# EAGLE design punta (EAGLE 7.5.0)
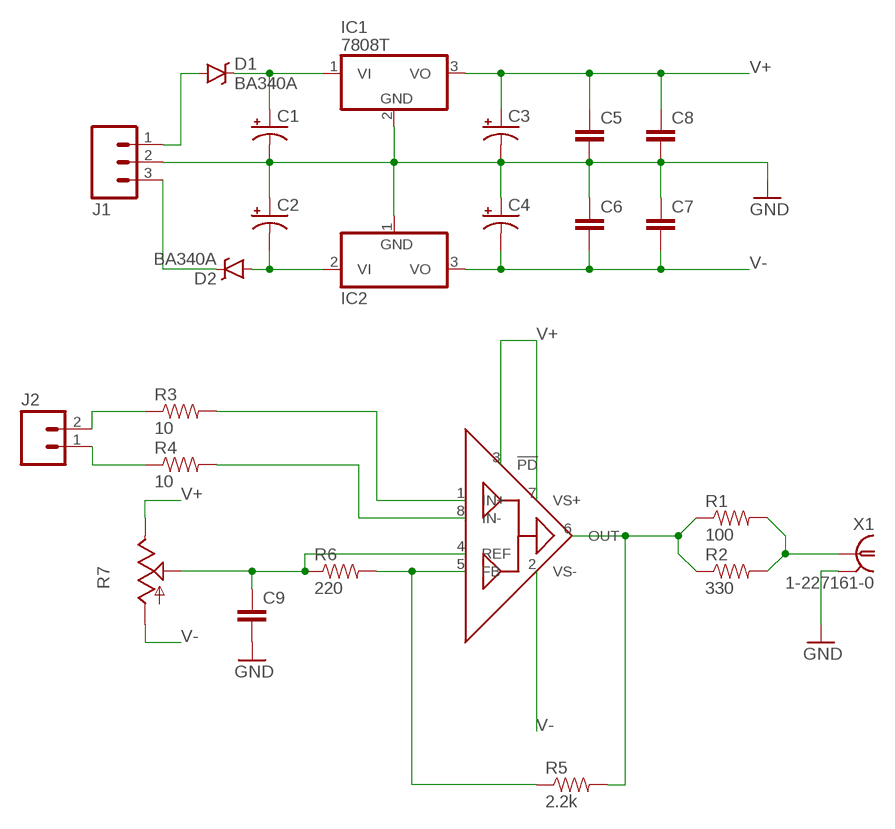
[diagram p0: schematic, sheet 1]

## Parts
C1  CAP_POL1206-KIT  [EIA3216-KIT]
C2  CAP_POL1206-KIT  [EIA3216-KIT]
C3  CAP_POL1206-KIT  [EIA3216-KIT]
C4  CAP_POL1206-KIT  [EIA3216-KIT]
C5  CAP0805  [0805]
C6  CAP0805  [0805]
C7  CAP0805  [0805]
C8  CAP0805  [0805]
C9  CAP0805  [0805]
D1  BA340A  B340A  [SMA-DIODE]
D2  BA340A  B340A  [SMA-DIODE]
IC1  7808T  [TO220H]
IC2  7908T  [TO220H]
J1  M03-SCREW-5MM  [SCREWTERMINAL-5MM-3]
J2  M02PTH  [1X02]
R1  100  RESISTOR0805-RES  [0805]
R2  330  RESISTOR0805-RES  [0805]
R3  10  RESISTOR0805-RES  [0805]
R4  10  RESISTOR0805-RES  [0805]
R5  2.2k  RESISTOR0805-RES  [0805]
R6  220  RESISTOR0805-RES  [0805]
R7  TRIM_US-B64Y  [B64Y]
U$1  AD8129ARZ  [SOIC8]
X1  1-227161-0  [AMP_227161]

## Nets
GND: C1.C(-) C2.A(+) C3.C(-) C4.A(+) C5.2 C6.1 C7.1 C8.2 C9.2 IC1.2(GND) IC2.1(GND) J1.2 X1.2
N$1: D1.A J1.1
N$2: C1.A(+) D1.C IC1.1(VI)
N$3: R1.1 R2.1 R5.2 U$1.6(OUT)
N$4: C2.C(-) D2.A IC2.2(VI)
N$5: D2.C J1.3
N$6: R1.2 R2.2 X1.1
N$8: R3.2 U$1.1(IN+)
N$9: R4.2 U$1.8(IN-)
N$10: J2.2 R3.1
N$11: J2.1 R4.1
N$12: R5.1 R6.2 U$1.5(FB)
N$13: C9.1 R6.1 R7.S U$1.4(REF)
V+: C3.A(+) C5.1 C8.1 IC1.3(VO) R7.E U$1.3(!PD) U$1.7(VS+)
V-: C4.C(-) C6.2 C7.2 IC2.3(VO) R7.A U$1.2(VS-)

## Library data of the parts
C1-C4 = SparkFun-Capacitors:CAP_POL: Capacitor Polarized These are standard SMD and PTH capacitors. Normally 10uF, 47uF, and 100uF in electrolytic and tantalum varieties. Always verify the external diameter of the through hole cap, it varies with capacity, voltage, and manufacturer. The EIA devices should be standard.
C5-C9 = SparkFun-Capacitors:CAP: Capacitor Standard 0603 ceramic capacitor, and 0.1" leaded capacitor.
D1 D2 = SparkFun-DiscreteSemi:B340A: Schottky Diode 3A-40V; PROD_ID: DIO-09886
IC1 = linear:78*: Positive VOLTAGE REGULATOR Source: http://cache.national.com/ds/LM/LM78L05.pdf http://www.fairchildsemi.com/ds/LM/LM7805.pdf
IC2 = linear:79*: Negative VOLTAGE REGULATOR
J1 = SparkFun-Connectors:M03: Header 3 Standard 3-pin 0.1" header. Use with straight break away headers (SKU : PRT-00116), right angle break away headers (PRT-00553), swiss pins (PRT-00743), machine pins (PRT-00117), and female headers (PRT-00115). Molex polarized connector foot print use with SKU : PRT-08232 with associated crimp pins and housings.; STOREFRONT_ID: PRT-08433
J2 = SparkFun-Connectors:M02: Standard 2-pin 0.1" header. Use with - straight break away headers ( PRT-00116) - right angle break away headers (PRT-00553) - swiss pins (PRT-00743) - machine pins (PRT-00117) - female headers (PRT-00115) Molex polarized connector foot print use with: PRT-08233 with associated crimp pins and housings. 2.54_SCREWTERM for use with PRT-10571. 3.5mm Screw Terminal footprints for PRT-08084 5mm Screw Terminal footprints for use with PRT-08432
R1-R6 = SparkFun-Passives:RESISTOR: Resistor Basic schematic elements and footprints for 0603, 1206, and PTH resistors.
R7 = pot:TRIM_US-: POTENTIOMETER
U$1 = AD8129:AD8129: Low Cost 200 MHz Differential Receiver Amplifier
X1 = con-coax:?227161*: JACK, RIGHT ANGLE, 50 OHM, PCB, BNC Source: amp_227161.pdf; MF: TYCO ELECTRONICS; MPN: 1-227161; OC_FARNELL: unknown; OC_NEWARK: 33B3200

## Board
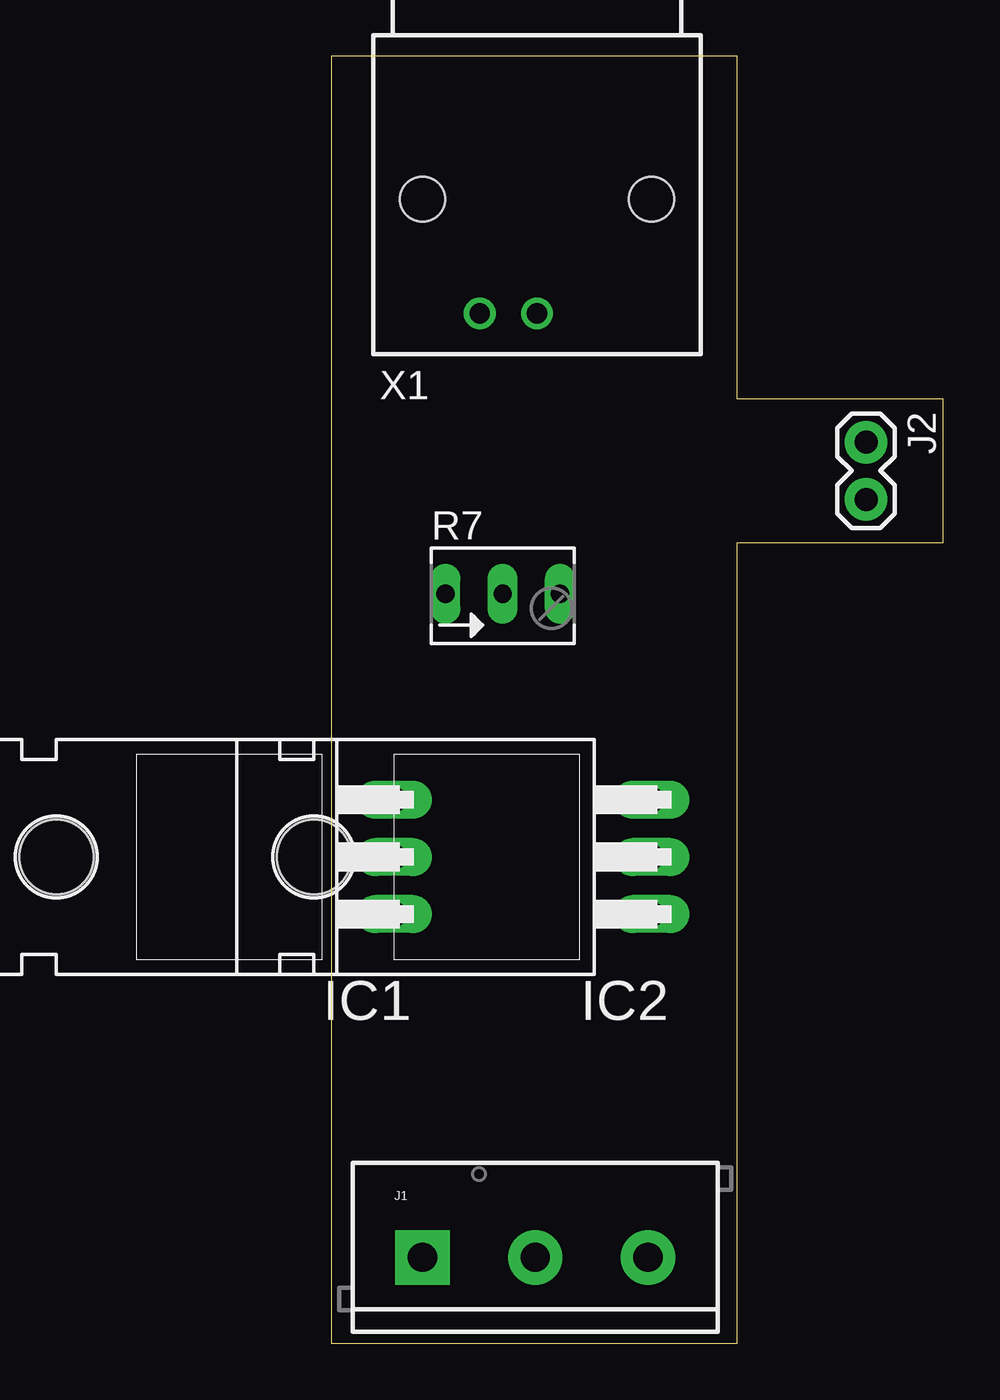
[diagram p1: board, top side]
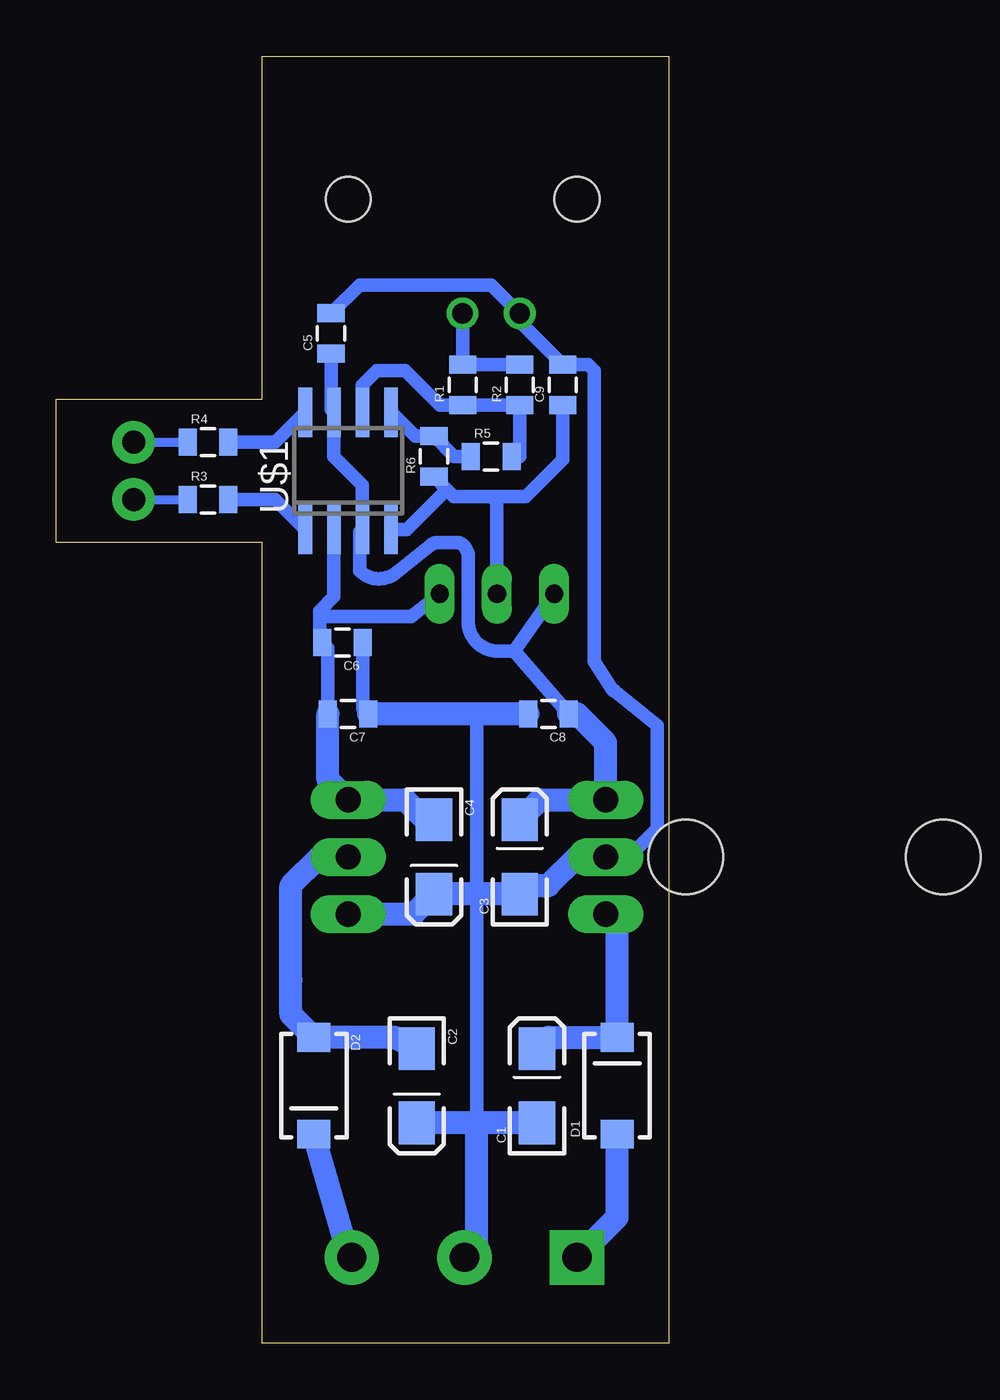
[diagram p2: board, bottom side, seen from below]

Size 27.18 x 57.14 mm. Coordinates in mm from the lower left corner, seen from the top.
Outline: 0,0 18.03,0 18.03,35.56 27.18,35.56 27.18,41.91 18.03,41.91 18.03,57.14 0,57.14 0,0
Copper layers (1*16): Top 0.035mm / dielectric 1.5mm / Bottom 0.035mm
Design rules "default": minimum track width 10mil, minimum drill 24mil, track to track 8mil, track to pad 8mil, pad to pad 8mil, via to via 8mil, smd to smd 8mil, copper to edge 40mil, drill to drill 8mil, minimum pad ring 10mil, minimum via ring 8mil, stop-mask expansion 4mil, vias tented up to drill 0mil, thermal gap 10mil

### Footprints (pad centres in the part's own frame; a part is rotated, then mirrored left to right if it is on the bottom)
EIA3216-KIT = smd 1.9 x 1.6: A 1.65,0; C -1.65,0
0805 = smd 0.8 x 1.2: 1 -0.9,0; 2 0.9,0
SMA-DIODE = smd 1.27 x 1.47: A -2.15,0; C 2.15,0
TO220H = drill 1.118 long: 1 -2.54,-10.16; 2 0,-10.16; 3 2.54,-10.16 | hole 3.302: 0,4.826
SCREWTERMINAL-5MM-3 = drill 1.3 pad 2.413 square: 1 0,0 | drill 1.3 pad 2.413: 2 5,0; 3 10,0
1X02 = drill 1.016 pad 1.88: 1 0,0; 2 2.54,0
B64Y = drill 0.813 long: A 2.54,0; E -2.54,0; S 0,0
SOIC8 = smd 0.6 x 2.2: 1 -1.905,-2.6; 2 -0.635,-2.6; 3 0.635,-2.6; 4 1.905,-2.6; 5 1.905,2.6; 6 0.635,2.6; 7 -0.635,2.6; 8 -1.905,2.6
AMP_227161 = drill 0.9 pad 1.27: 1 0,-5.08; 2 -2.54,-5.08 | hole 2: -5.08,0; 5.08,0

### Placement (x,y rotation side)
C1  5.84,11.43 90 bottom
C2  11.18,11.43 270 bottom
C3  6.6,21.59 90 bottom
C4  10.41,21.59 270 bottom
C5  14.99,44.83 90 bottom
C6  14.48,31.11 180 bottom
C7  14.22,27.94 180 bottom
C8  5.33,27.94 180 bottom
C9  4.7,42.55 90 bottom
D1  2.29,11.43 90 bottom
D2  15.75,11.43 270 bottom
IC1  -7.37,21.59 90 top
IC2  4.06,21.59 90 top
J1  4.06,3.81 0 top
J2  23.75,40.01 270 top
R1  9.14,42.55 90 bottom
R2  6.6,42.55 90 bottom
R3  20.45,37.47 0 bottom
R4  20.45,40.01 0 bottom
R5  7.87,39.37 0 bottom
R6  10.41,39.37 90 bottom
R7  7.62,33.27 0 top
U$1  14.22,38.73 0 bottom
X1  9.14,50.8 0 top

### Tracks (layer width: path | path; a pad name or v marks a point on that pad's centre or on a via)
GND
  Bottom 0.61: 8.51,27.94 8.51,19.94 8.51,9.78 C2.A | C5.2 13.72,46.99 7.87,46.99 X1.2 6.6,45.35 C9.2 3.57,43.45 3.3,43.18 3.3,30.26 2.5,29.02 2.35,28.92 0.51,27.43 0.51,22.86 1.78,21.59 IC1.2 | C6.1 13.58,28.19 C7.1
  Bottom 1.016: C1.C C2.A | C8.2 8.51,27.94 C7.1 | IC2.1 11.3,19.05 C4.A 8.51,19.94 C3.C 6.22,20.32 5.33,20.32 4.06,21.59 IC1.2 | J1.2 8.51,4.37 8.51,9.78
N$1
  Bottom 1.016: J1.1 2.29,5.59 D1.A
N$2
  Bottom 0.61: C1.A arc90 5.34,13.58 | 2.29,18.54 IC1.1
  Bottom 1.016: 5.34,13.58 D1.C 2.29,18.54
N$3
  Bottom 0.61: R5.2 6.6,39.37 R2.1 R1.1 10.15,41.65 11.68,43.18 12.95,43.18 13.59,42.55 U$1.6
N$4
  Bottom 1.016: IC2.2 15.49,21.59 16.76,20.32 16.76,16.12 16.76,14.6 D2.A 12.18,13.58 C2.C
N$5
  Bottom 1.016: J1.3 14.22,3.97 D2.C
N$6
  Bottom 0.61: R2.2 R1.2 X1.1
N$8
  Bottom 0.61: R3.2 17.46,37.47 U$1.1
N$9
  Bottom 0.61: R4.2 17.46,40.01 U$1.8
N$10
  Bottom 0.406: J2.2 R3.1
N$11
  Bottom 0.406: J2.1 R4.1
N$12
  Bottom 0.61: U$1.5 11.25,40.27 R6.2 9.51,39.37 R5.1
N$13
  Bottom 0.61: C9.1 4.7,39.24 6.35,37.59 7.87,37.59 | 7.87,37.59 9.54,37.59 9.85,37.9 | 9.85,37.9 R6.1 | U$1.4 11.62,36.13 9.85,37.9 | R7.S 7.62,37.34 7.87,37.59
V+
  Bottom 0.61: U$1.3 13.59,38.1 14.86,39.37 U$1.7 14.99,41.46 C5.1 | U$1.3 13.59,35.94 13.72,35.81 | U$1.3 13.72,36.01 13.72,34.29 arc-84 12.11,34.2 10.57,35.44 arc39 10.21,35.56 9.46,35.56 arc63 9,35.28 8.89,35.05 8.89,32.03 arc-90 7.6,30.73 6.86,30.73 | C8.1 6.86,30.73 | 6.86,30.73 R7.E
  Bottom 1.016: C8.1 4.06,27.94 2.79,26.67 IC1.3 5.71,24.13 C3.A
V-
  Bottom 0.61: U$1.2 14.86,33.15 15.49,32.51 15.49,32.26 | 15.49,32.26 15.49,31.23 C6.2 15.12,30.86 C7.2 | R7.A 11.43,32.26 15.49,32.26
  Bottom 1.016: C7.2 15.12,25.03 IC2.3 11.68,24.13 10.79,23.24 C4.C